# EAGLE schematic RMCQ_Control & Indicator module (EAGLE 9.5.0)
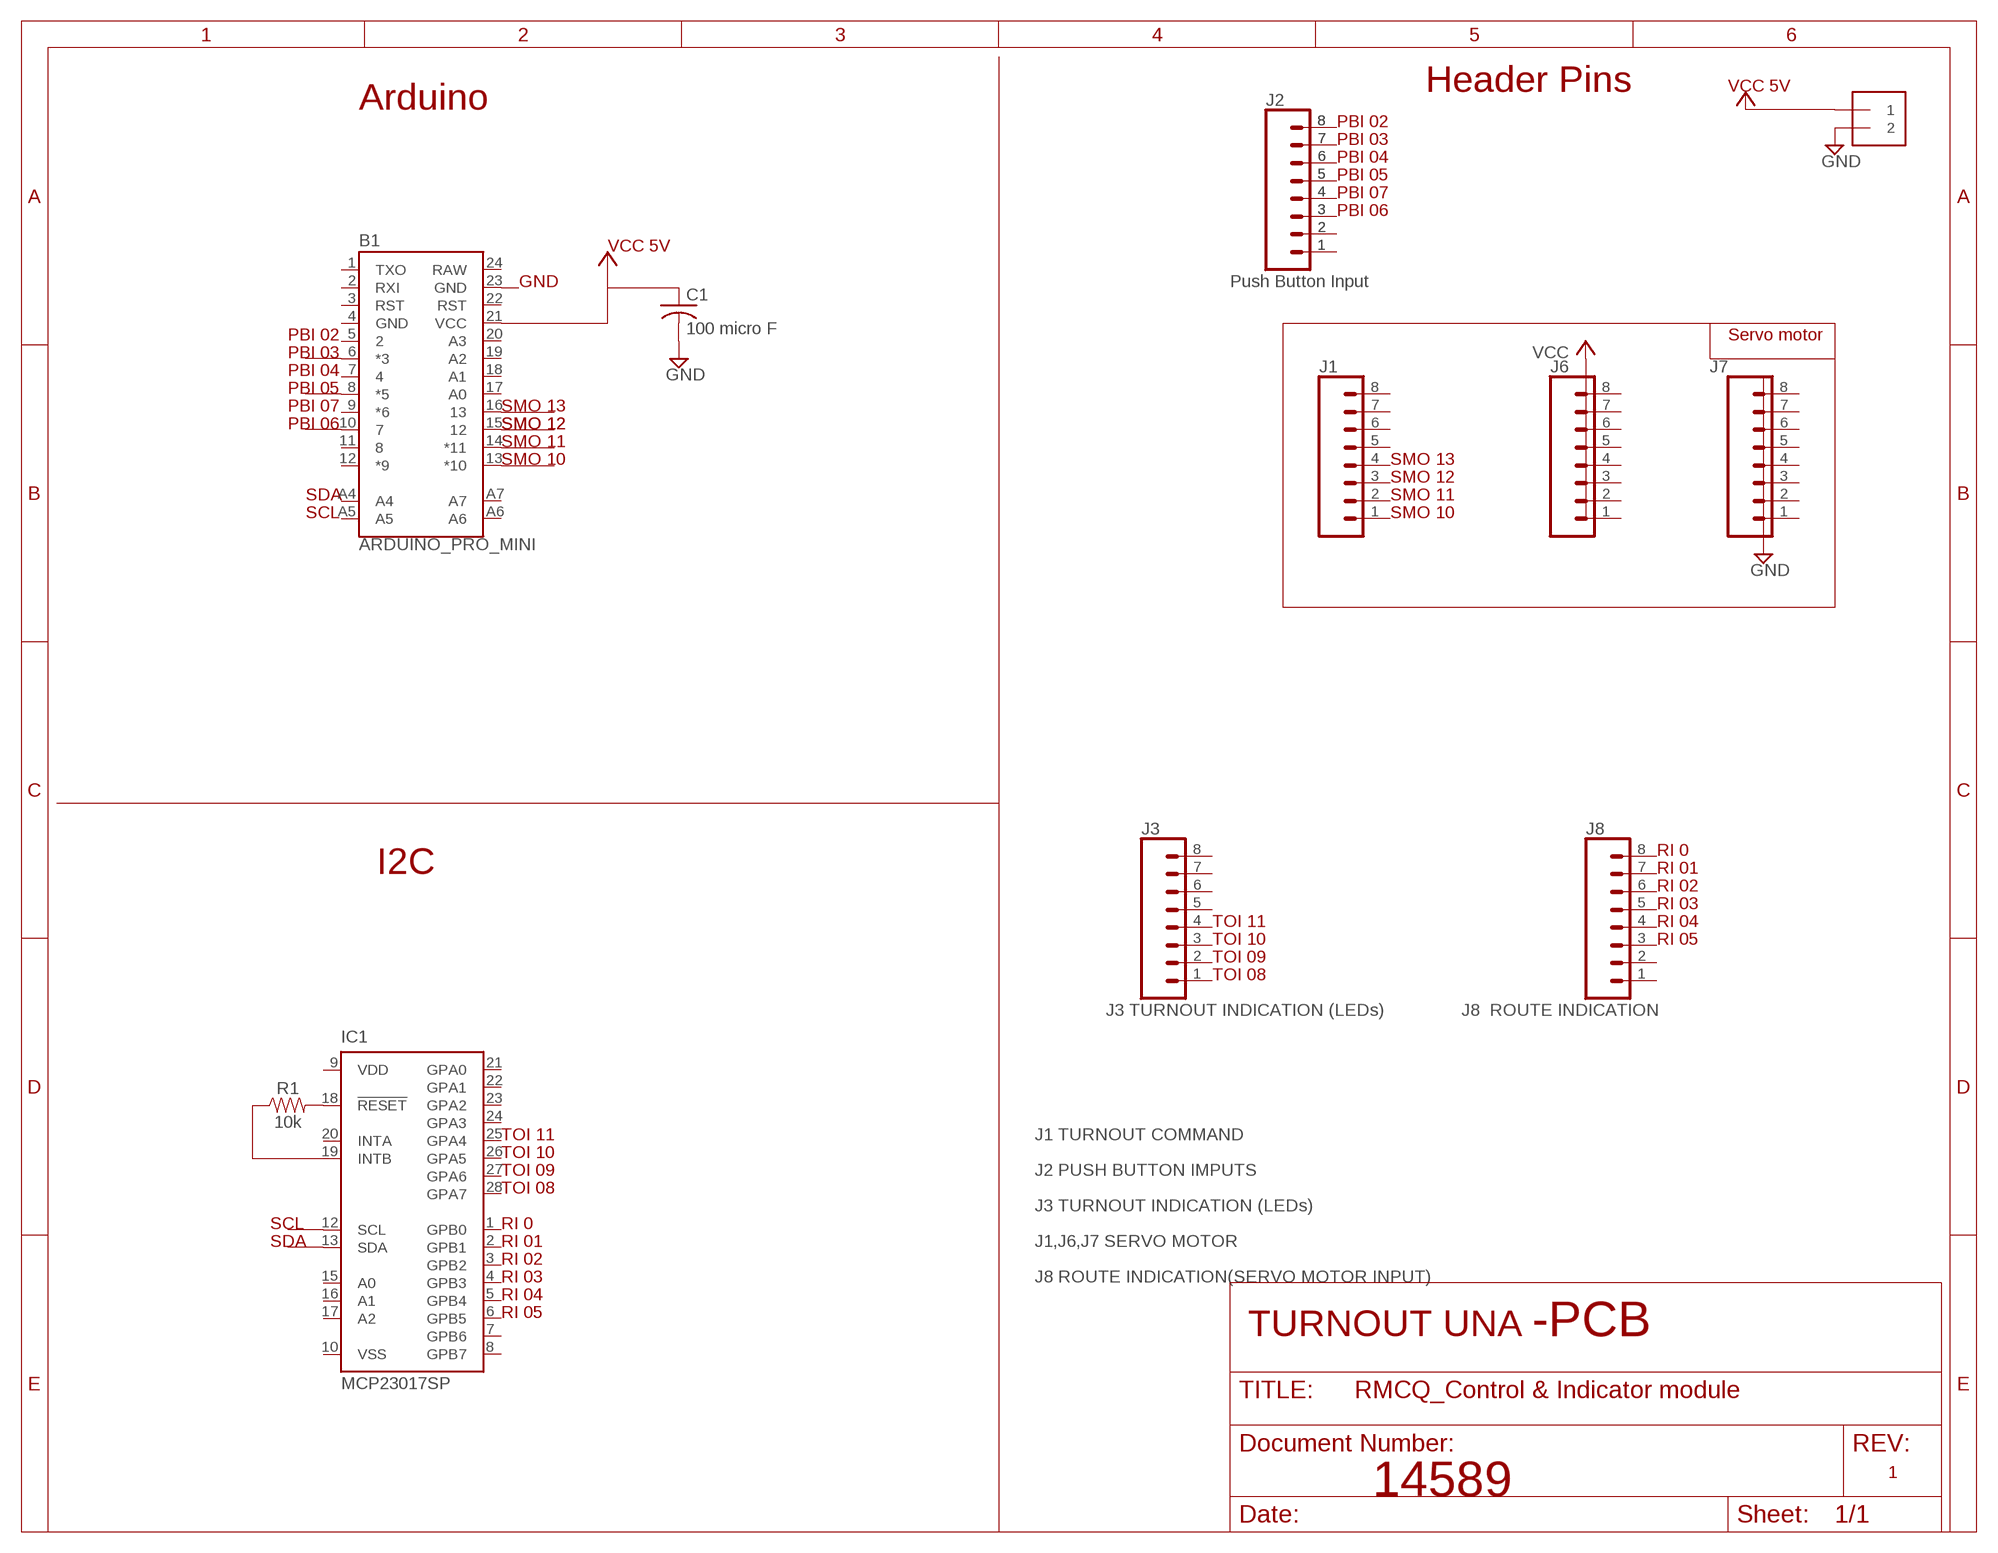
[diagram p0: schematic, sheet 1]

## Parts
B1  ARDUINO_PRO_MINI  [ARDUINO_PRO_MINI]
C1  100 micro F  C-US050-050X075  [C050-050X075]
IC1  MCP23017SP  [DIL28-3]
J1  CONN_08"  [1X08]
J2  CONN_08"  [1X08]
J3  CONN_08"  [1X08]
J4  CONN_08"  [1X08]
J5  1X2-3.5MM  [1X2-3.5MM]
J6  CONN_08"  [1X08]
J7  CONN_08"  [1X08]
J8  CONN_08"  [1X08]
R1  10k  10KOHM-HORIZ-1/4W-5%  [AXIAL-0.3]

## Nets
GND: C1.2 J5.2
N$1: J2.1 J4.1
N$2: J2.2 J4.2
N$3: J2.3 J4.3
N$4: J2.4 J4.4
N$5: J2.5 J4.5
N$6: J2.6 J4.6
N$7: J2.7 J4.7
N$8: J2.8 J4.8
N$9: IC1.18(!RESET) R1.P$2
Unconnected: B1.1(TXO) B1.2(RXI) B1.3(RST) B1.5 B1.6(*3) B1.7 B1.8(*5) B1.9(*6) B1.10 B1.11 B1.12(*9) B1.13(*10) B1.14(*11) B1.15 B1.16 B1.17(A0) B1.18(A1) B1.19(A2) B1.20(A3) B1.22(RST) B1.A4 B1.A5 B1.A6 B1.A7 C1.1 IC1.1(GPB0) IC1.2(GPB1) IC1.3(GPB2) IC1.4(GPB3) IC1.5(GPB4) IC1.6(GPB5) IC1.7(GPB6) IC1.8(GPB7) IC1.12(SCL) IC1.13(SDA) IC1.15(A0) IC1.16(A1) IC1.17(A2) IC1.19(INTB) IC1.20(INTA) IC1.21(GPA0) IC1.22(GPA1) IC1.23(GPA2) IC1.24(GPA3) IC1.25(GPA4) IC1.26(GPA5) IC1.27(GPA6) IC1.28(GPA7) J1.1 J1.2 J1.3 J1.4 J1.5 J1.6 J1.7 J1.8 J3.1 J3.2 J3.3 J3.4 J3.5 J3.6 J3.7 J3.8 J5.1 J6.1 J6.2 J6.3 J6.4 J6.5 J6.6 J6.7 J6.8 J7.1 J7.2 J7.3 J7.4 J7.5 J7.6 J7.7 J7.8 J8.1 J8.2 J8.3 J8.4 J8.5 J8.6 J8.7 J8.8 R1.P$1

## Notes on the sheet
- Header Pins | VCC 5V
- Arduino
- PBI 02
- PBI 03
- PBI 04
- PBI 05
- PBI 07
- PBI 06
- VCC 5V
- GND | Push Button Input
- PBI 02 | Servo motor
- PBI 03
- PBI 04
- PBI 05
- PBI 07 | SMO 13
- PBI 06 | SMO 12 | SMO 12
- SMO 11
- SMO 10 | SMO 13
- SMO 12
- SDA | SMO 11
- SCL | SMO 10
- RI 0
- I2C | RI 01
- RI 02
- RI 03
- TOI 11 | RI 04
- TOI 10 | RI 05
- TOI 09
- TOI 08
- J3 TURNOUT INDICATION (LEDs) | J8  ROUTE INDICATION
- TOI 11 | J1 TURNOUT COMMAND
- TOI 10
- TOI 09 | J2 PUSH BUTTON IMPUTS
- TOI 08
- J3 TURNOUT INDICATION (LEDs)
- SCL | RI 0
- SDA | RI 01 | J1,J6,J7 SERVO MOTOR
- RI 02
- RI 03 | J8 ROUTE INDICATION(SERVO MOTOR INPUT)
- RI 04
- RI 05
- TURNOUT UNA | -PCB
- 1
- 14589

## Power pins joined to a net without a drawn wire
GND: B1.4(GND) B1.23(GND)
RAW: B1.24(RAW)
VCC: B1.21(VCC)
VDD: IC1.9(VDD)
VSS: IC1.10(VSS)

## Library data of the parts
B1 = SparkFun-Boards:ARDUINO_PRO_MINI: SparkFun Pro Mini Pro Mini compatible footprint. Dimensions: 0.7 x 1.3" PCB Thickness: 0.8mm SparkFun Products: 3.3V/8MHz <https://www.sparkfun.com/products/11114> 5V/16MHz <https://www.sparkfun.com/products/11113>
C1 = adafruit:C-US: CAPACITOR, American symbol
IC1 = adafruit:MCP23017: http://ww1.microchip.com/downloads/en/DeviceDoc/21952a.pdf Source: http://ww1.microchip.com/downloads/en/DeviceDoc/21952a.pdf
J1-J4 J6-J8 = SparkFun-Connectors:CONN_08: Multi connection point. Often used as Generic Header-pin footprint for 0.1 inch spaced/style header connections On any of the 0.1 inch spaced packages, you can populate with these: Break Away Headers - Straight <https://www.sparkfun.com/products/116> (PRT-00116) Break Away Male Headers - Right Angle <https://www.sparkfun.com/products/553> (PRT-00553) Female Headers <https://www.sparkfun.com/products/115> (PRT-00115) Break Away Headers - Machine Pin <https://www.sparkfun.com/products/117> (PRT-00117) Break Away Female Headers - Swiss Machine Pin <https://www.sparkfun.com/products/743> (PRT-00743) Arduino Stackable Header - 8 Pin <https://www.sparkfun.com/products/9279> (PRT-09279) For SCREWTERMINALS and SPRING TERMINALS visit here: Screw Terimnals on SparkFun.com <https://www.sparkfun.com/search/results?term=Screw+Terminals> (5mm/3.5mm/2.54mm spacing) This device is also useful as a general connection point to wire up your design to another part of your project. Our various solder wires solder well into these plated through hole pads. Hook-Up Wire - Assortment (Stranded, 22 AWG) <https://www.sparkfun.com/products/11375> (PRT-11375) Hook-Up Wire - Assortment (Solid Core, 22 AWG) <https://www.sparkfun.com/products/11367> (PRT-11367) View the entire wire category on our website here <https://www.sparkfun.com/categories/141> Special notes: Molex polarized connector foot print use with SKU : PRT-08231 with associated crimp pins and housings. 1MM SMD Version SKU: PRT-10208 NOTES ON THE VARIANTS LOCK and LOCK_LONGPADS... This footprint was designed to help hold the alignment of a through-hole component (i.e. 6-pin header) while soldering it into place. You may notice that each hole has been shifted either up or down by 0.005 of an inch from it's more standard position (which is a perfectly straight line). This slight alteration caused the pins (the squares in the middle) to touch the edges of the holes. Because they are alternating, it causes a "brace" to hold the component in place. 0.005 has proven to be the perfect amount of "off-center" position when using our standard breakaway headers. Although looks a little odd when you look at the bare footprint, once you have a header in there, the alteration is very hard to notice. Also,if you push a header all the way into place, it is covered up entirely on the bottom side.; PROD_ID: CONN-08438
J5 = adafruit:1X2: 3.5mm Terminal block http://www.ladyada.net/library/pcb/eaglelibrary.html
R1 = SparkFun-Resistors:10KOHM: 10kΩ resistor A resistor is a passive two-terminal electrical component that implements electrical resistance as a circuit element. Resistors act to reduce current flow, and, at the same time, act to lower voltage levels within circuits. - Wikipedia; PROD_ID: RES-09435